# EAGLE design OUTPUT UNIT (EAGLE 9.5.0)
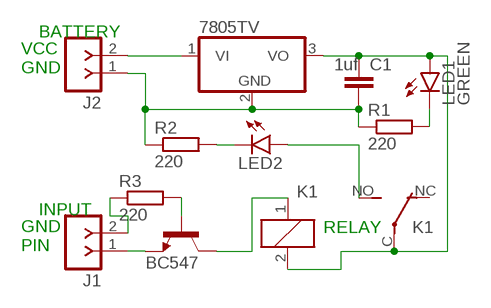
[diagram p0: schematic, sheet 1]

## Parts
C1  1uf  C-EU025-025X050  [C025-025X050]
IC1  7805TV  [TO220V]
J1  F-1X02-SIP-100-32Y  [SIP-100-02-32Y]
J2  F-1X02-SIP-100-32Y  [SIP-100-02-32Y]
K1  CQ1-12V  [CQ1]
LED1  GREEN  LEDSML1206  [SML1206]
LED2  RED  LED5MM  [LED5MM]
R1  220  R-EU_0204/7  [0204/7]
R2  220  R-EU_0204/7  [0204/7]
R3  220  R-EU_0204/7  [0204/7]
T1  BC547  [TO92]

## Nets
N$1: IC1.1(VI) J2.2
N$2: J1.1 T1.1(E)
N$3: LED1.C R1.2
N$4: J1.2 R3.1
N$5: C1.1 IC1.3(VO) K1.2 K1.C(2:P) LED1.A
N$6: C1.2 IC1.2(GND) J2.1 R1.1 R2.1
N$7: LED2.K(C) R2.2
N$8: K1.NO(2:S) LED2.A
N$9: K1.1 T1.3(C)
N$10: R3.2 T1.2(B)
Unconnected: K1.NC(2:O)

## Notes on the sheet
- BATTERY
- VCC
  GND
- INPUT
- RELAY
- GND
  PIN

## Library data of the parts
C1 = rcl:C-EU: CAPACITOR, European symbol; SPICEPREFIX: C
IC1 = linear:78*: Positive VOLTAGE REGULATOR Source: http://cache.national.com/ds/LM/LM78L05.pdf http://www.fairchildsemi.com/ds/LM/LM7805.pdf
J1 J2 = con-headers-jp:F-1X02-: FEMALE HEADER
K1 = relay:CQ1-12V: AUTOMOTIVE QUIET RELAY NAiS Source: http://www.mew-europe.com/.. en_ds_61208_0000.pdf; OC_FARNELL: unknown; OC_NEWARK: unknown
LED1 LED2 = led:LED: LED OSRAM: - CHIPLED LG R971, LG N971, LY N971, LG Q971, LY Q971, LO R971, LY R971 LH N974, LH R974 LS Q976, LO Q976, LY Q976 LO Q996 - Hyper CHIPLED LW Q18S LB Q993, LB Q99A, LB R99A - SideLED LS A670, LO A670, LY A670, LG A670, LP A670 LB A673, LV A673, LT A673, LW A673 LH A674 LY A675 LS A676, LA A676, LO A676, LY A676, LW A676 LS A679, LY A679, LG A679 - Hyper Micro SIDELED® LS Y876, LA Y876, LO Y876, LY Y876 LT Y87S - SmartLED LW L88C, LW L88S LB L89C, LB L89S, LG L890 LS L89K, LO L89K, LY L89K LS L896, LA L896, LO L896, LY L896 - TOPLED LS T670, LO T670, LY T670, LG T670, LP T670 LSG T670, LSP T670, LSY T670, LOP T670, LYG T670 LG T671, LOG T671, LSG T671 LB T673, LV T673, LT T673, LW T673 LH T674 LS T676, LA T676, LO T676, LY T676, LB T676, LH T676, LSB T676, LW T676 LB T67C, LV T67C, LT T67C, LS T67K, LO T67K, LY T67K, LW E67C LS E67B, LA E67B, LO E67B, LY E67B, LB E67C, LV E67C, LT E67C LW T67C LS T679, LY T679, LG T679 LS T770, LO T770, LY T770, LG T770, LP T770 LB T773, LV T773, LT T773, LW T773 LH T774 LS E675, LA E675, LY E675, LS T675 LS T776, LA T776, LO T776, LY T776, LB T776 LHGB T686 LT T68C, LB T68C - Hyper Mini TOPLED® LB M676 - Mini TOPLED Santana® LG M470 LS M47K, LO M47K, LY M47K Source: http://www.osram.convergy.de LUXEON: - LUMILED® LXK2-PW12-R00, LXK2-PW12-S00, LXK2-PW14-U00, LXK2-PW14-V00 LXK2-PM12-R00, LXK2-PM12-S00, LXK2-PM14-U00 LXK2-PE12-Q00, LXK2-PE12-R00, LXK2-PE12-S00, LXK2-PE14-T00, LXK2-PE14-U00 LXK2-PB12-K00, LXK2-PB12-L00, LXK2-PB12-M00, LXK2-PB14-N00, LXK2-PB14-P00, LXK2-PB14-Q00 LXK2-PR12-L00, LXK2-PR12-M00, LXK2-PR14-Q00, LXK2-PR14-R00 LXK2-PD12-Q00, LXK2-PD12-R00, LXK2-PD12-S00 LXK2-PH12-R00, LXK2-PH12-S00 LXK2-PL12-P00, LXK2-PL12-Q00, LXK2-PL12-R00 Source: www.luxeon.com KINGBRIGHT: KA-3528ASYC Source: www.kingbright.com
R1-R3 = rcl:R-EU_: RESISTOR, European symbol; SPICEPREFIX: R
T1 = transistor:BC547: NPN TRANSISTOR

## Board
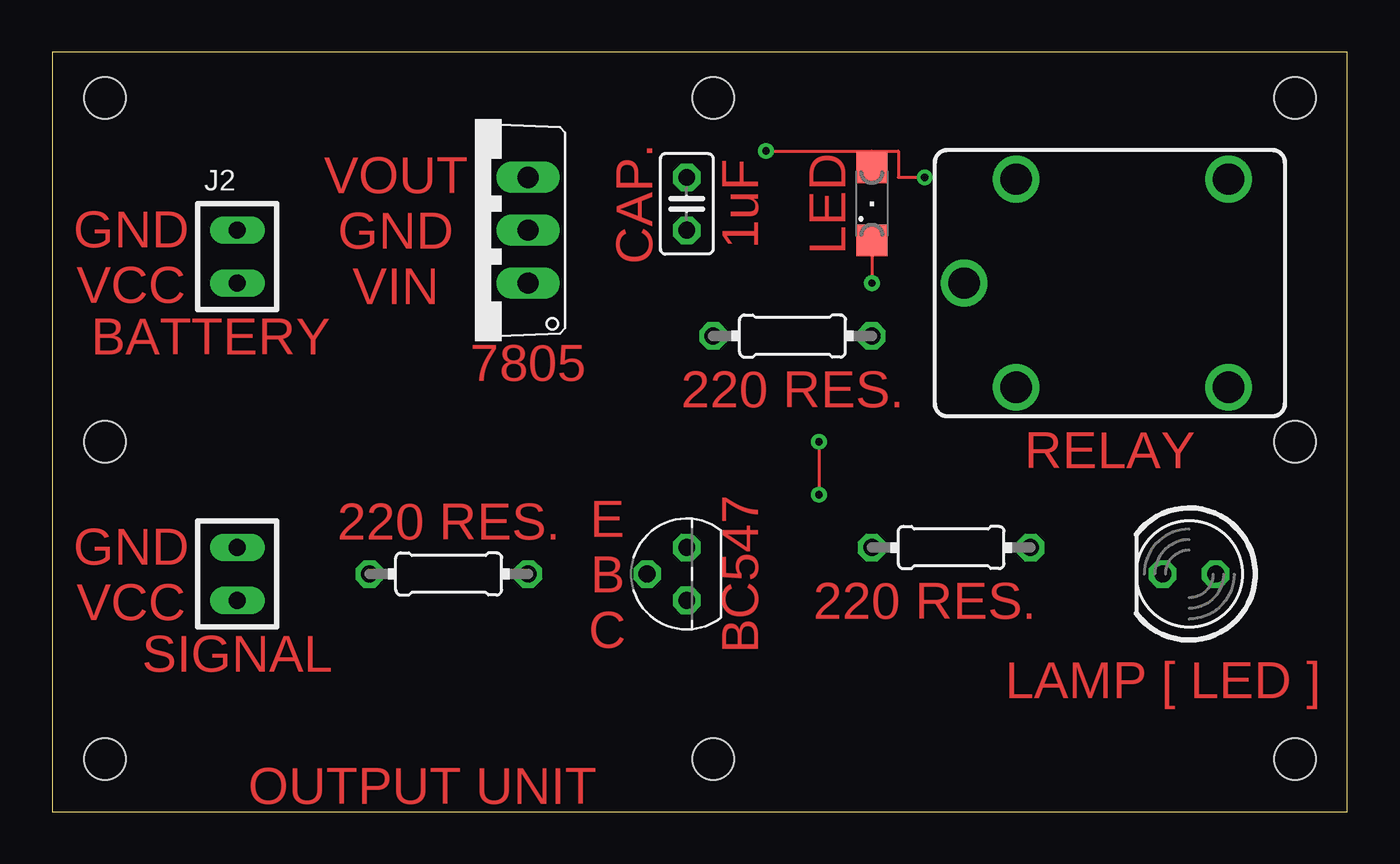
[diagram p1: board, top side]
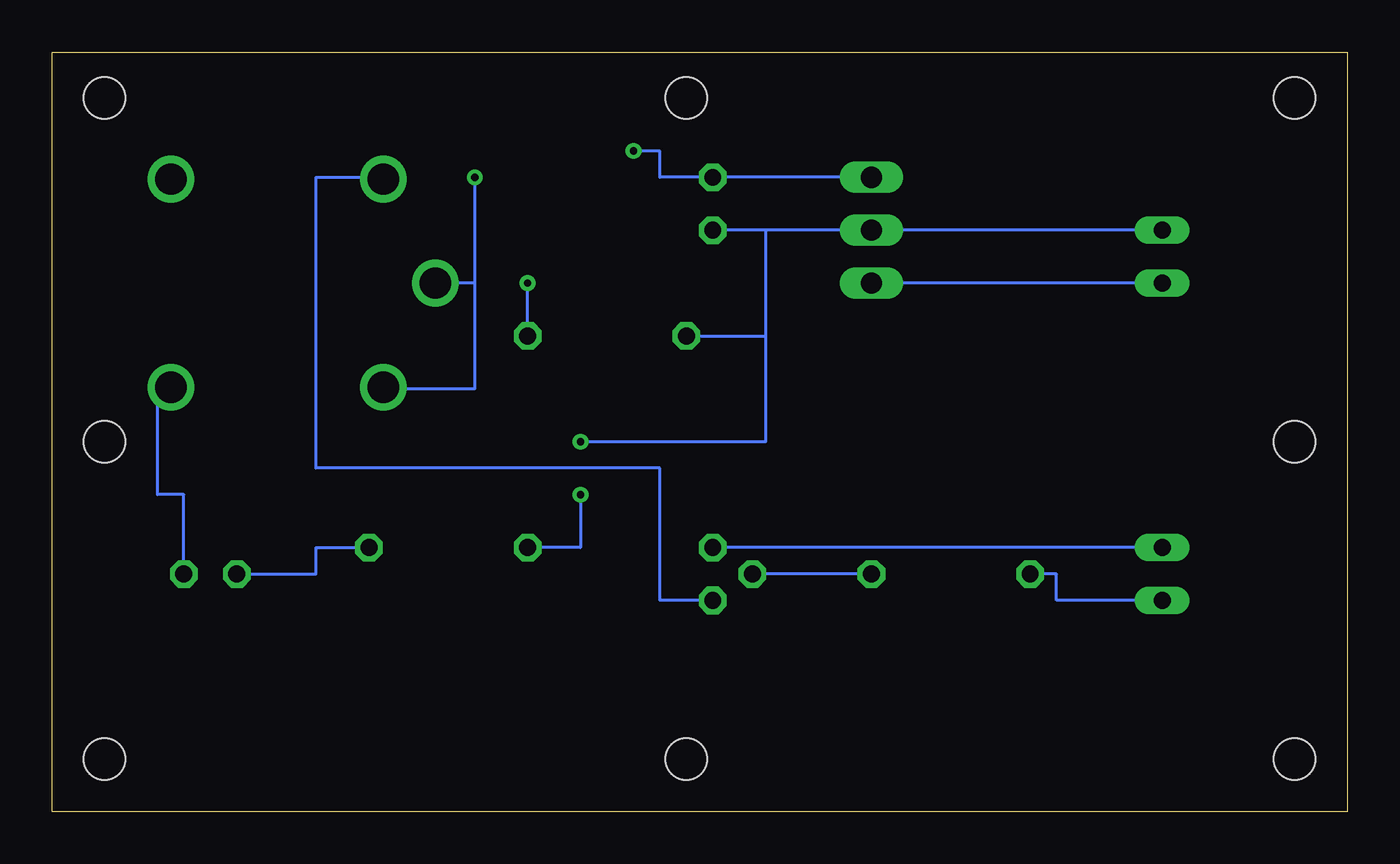
[diagram p2: board, bottom side, seen from below]

Size 62.21 x 36.5 mm. Coordinates in mm from the lower left corner, seen from the top.
Outline: 0,0 62.21,0 62.21,36.5 0,36.5 0,0
Copper layers (1*16): Top 0.035mm / dielectric 1.5mm / Bottom 0.035mm
Design rules "default": minimum track width 6mil, minimum drill 0.35mm, track to track 6mil, track to pad 6mil, pad to pad 6mil, via to via 6mil, smd to smd 6mil, copper to edge 40mil, drill to drill 6mil, minimum pad ring 10mil, minimum via ring 8mil, stop-mask expansion 4mil, vias tented up to drill 0mil, thermal gap 10mil
Holes 2 mm at 2.54,2.54 2.54,34.29 59.69,34.29 31.75,34.29 31.75,2.54 59.69,2.54 2.54,17.78 59.69,17.78

### Footprints (pad centres in the part's own frame; a part is rotated, then mirrored left to right if it is on the bottom)
C025-025X050 = drill 0.813 octagon: 1 -1.27,0; 2 1.27,0
TO220V = drill 1.016 long: 1 -2.54,-2.54; 2 0,-2.54; 3 2.54,-2.54
SIP-100-02-32Y = drill 0.813 long: 1 -1.27,0; 2 1.27,0
CQ1 = drill 1.5: 1 4.5,-5; 2 4.5,5; C 7,0; NC -5.7,-5; NO -5.7,5
SML1206 = smd 1.5 x 1.5: A 1.75,0; C -1.75,0
LED5MM = drill 0.813 octagon: A -1.27,0; K 1.27,0
0204/7 = drill 0.813 octagon: 1 -3.81,0; 2 3.81,0
TO92 = drill 0.813 octagon: 1 1.27,0; 2 0,1.905; 3 -1.27,0

### Placement (x,y rotation side)
C1  30.48,29.21 270 top
IC1  20.32,27.94 90 top
J1  8.89,11.43 270 top
J2  8.89,26.67 270 top
K1  50.8,25.4 180 top
LED1  39.37,29.21 90 top
LED2  54.61,11.43 180 top
R1  35.56,22.86 0 top
R2  43.18,12.7 0 top
R3  19.05,11.43 0 top
T1  30.48,11.43 90 top

### Tracks (layer width: path | path; a pad name or v marks a point on that pad's centre or on a via)
N$1
  Bottom 0.152: J2.2 IC1.1
N$2
  Bottom 0.152: J1.1 T1.1
N$3  (via drill 0.35)
  Top 0.152: LED1.C v39.37,25.4
  Bottom 0.152: R1.2 v39.37,25.4
N$4
  Bottom 0.152: J1.2 13.97,10.16 13.97,11.43 R3.1
N$5  (via drill 0.35)
  Top 0.152: v34.29,31.75 39.37,31.75 | LED1.A 39.37,31.75 | 39.37,31.75 40.64,31.75 40.64,30.48 v41.91,30.48
  Bottom 0.152: IC1.3 C1.1 33.02,30.48 33.02,31.75 v34.29,31.75 | v41.91,30.48 41.91,25.4 | 41.91,25.4 K1.C | K1.2 46.22,20.32 41.91,20.32 41.91,25.4
N$6  (via drill 0.35)
  Top 0.152: v36.83,17.78 v36.83,15.24
  Bottom 0.152: J2.1 IC1.2 27.94,27.94 | 27.94,27.94 C1.2 | R1.1 27.94,22.86 | 27.94,27.94 27.94,22.86 | 27.94,22.86 27.94,17.78 v36.83,17.78 | v36.83,15.24 36.83,12.7 R2.1
N$7
  Bottom 0.152: LED2.K 49.53,11.43 49.53,12.7 R2.2
N$8
  Bottom 0.152: LED2.A 55.88,15.24 57.15,15.24 57.15,19.75 K1.NO
N$9
  Bottom 0.152: T1.3 33.02,10.16 33.02,16.51 49.53,16.51 49.53,30.48 46.38,30.48 K1.1
N$10
  Bottom 0.152: R3.2 T1.2

### Text on the board
Top: CAP. | 1uF | LED | VOUT / GND / VIN | GND / VCC | BATTERY | 7805 | 220 RES. | RELAY | 220 RES. | GND / VCC | E / B / C | BC547 | 220 RES. | SIGNAL | LAMP [ LED ] | OUTPUT UNIT